# EAGLE design osi-brain_rev_1 (EAGLE 6.3)
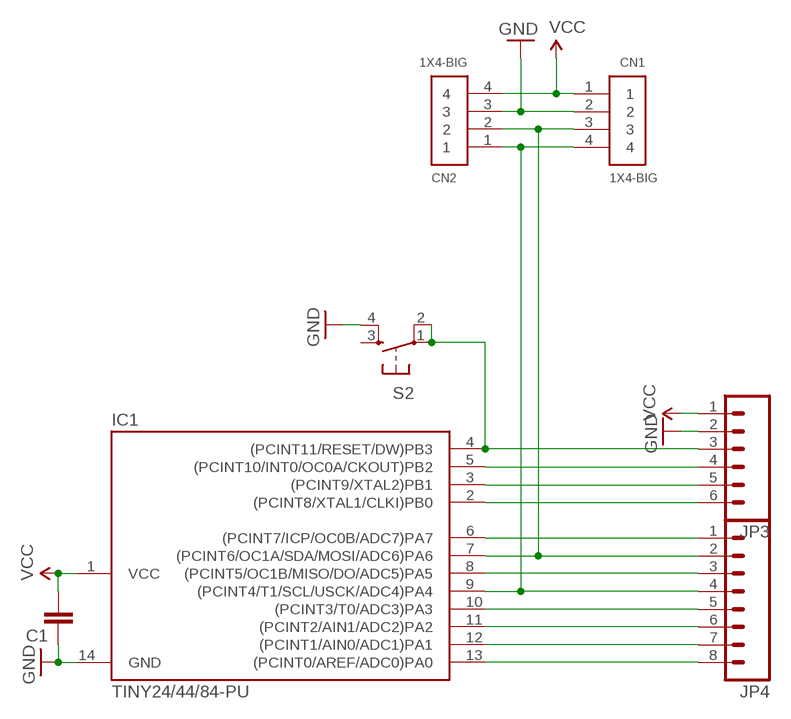
[diagram p0: schematic, sheet 1]

## Parts
C1  CAPKIT  [CAP-PTH-SMALL-KIT]
CN1  1X4-BIG  [1X04-BIG]
CN2  1X4-BIG  [1X04-BIG]
IC1  TINY24/44/84-PU  [DIL14]
JP3  M06SIP  [1X06]
JP4  M081X08  [1X08]
S2  TAC_SWITCHPTH  [TACTILE-PTH]

## Nets
D0: IC1.13((PCINT0/AREF/ADC0)PA0) JP4.8
D1: IC1.12((PCINT1/AIN0/ADC1)PA1) JP4.7
D2: IC1.11((PCINT2/AIN1/ADC2)PA2) JP4.6
D3: IC1.10((PCINT3/T0/ADC3)PA3) JP4.5
D4: CN1.4 CN2.1 IC1.9((PCINT4/T1/SCL/USCK/ADC4)PA4) JP4.4
D5: IC1.8((PCINT5/OC1B/MISO/DO/ADC5)PA5) JP4.3
D6: CN1.3 CN2.2 IC1.7((PCINT6/OC1A/SDA/MOSI/ADC6)PA6) JP4.2
D7: IC1.6((PCINT7/ICP/OC0B/ADC7)PA7) JP4.1
D8: IC1.5((PCINT10/INT0/OC0A/CKOUT)PB2) JP3.4
D9: IC1.3((PCINT9/XTAL2)PB1) JP3.5
D10: IC1.2((PCINT8/XTAL1/CLKI)PB0) JP3.6
GND: C1.1 CN1.2 CN2.3 IC1.14(GND) JP3.2 S2.4
RESET: IC1.4((PCINT11/RESET/DW)PB3) JP3.3 S2.1 S2.2
VCC: C1.2 CN1.1 CN2.4 IC1.1(VCC) JP3.1
Unconnected: S2.3

## Library data of the parts
C1 = SparkFun:CAP: Capacitor Standard 0603 ceramic capacitor, and 0.1" leaded capacitor.
CN1 CN2 = adafruit_mod:1X4: 4-pin connector
IC1 = avr-7:TINY24/44/84
JP3 = SparkFun_mod:M06: Header 6 Standard 6-pin 0.1" header. Use with straight break away headers (SKU : PRT-00116), right angle break away headers (PRT-00553), swiss pins (PRT-00743), machine pins (PRT-00117), and female headers (PRT-00115). Molex polarized connector foot print use with SKU : PRT-08094 with associated crimp pins and housings. NOTES ON THE VARIANTS LOCK and LOCK_LONGPADS... This footprint was designed to help hold the alignment of a through-hole component (i.e. 6-pin header) while soldering it into place. You may notice that each hole has been shifted either up or down by 0.005 of an inch from it's more standard position (which is a perfectly straight line). This slight alteration caused the pins (the squares in the middle) to touch the edges of the holes. Because they are alternating, it causes a "brace" to hold the component in place. 0.005 has proven to be the perfect amount of "off-center" position when using our standard breakaway headers. Although looks a little odd when you look at the bare footprint, once you have a header in there, the alteration is very hard to notice. Also, if you push a header all the way into place, it is covered up entirely on the bottom side. This idea of altering the position of holes to aid alignment will be further integrated into the Sparkfun Library for other footprints. It can help hold any component with 3 or more connection pins.
JP4 = SparkFun_mod:M08: Header 8 Standard 8-pin 0.1" header. Use with straight break away headers (SKU : PRT-00116), right angle break away headers (PRT-00553), swiss pins (PRT-00743), machine pins (PRT-00117), and female headers (PRT-00115).
S2 = SparkFun:TAC_SWITCH: Momentary Switch Button commonly used for reset or general input. Spark Fun Electronics SKU : COM-00097

## Board
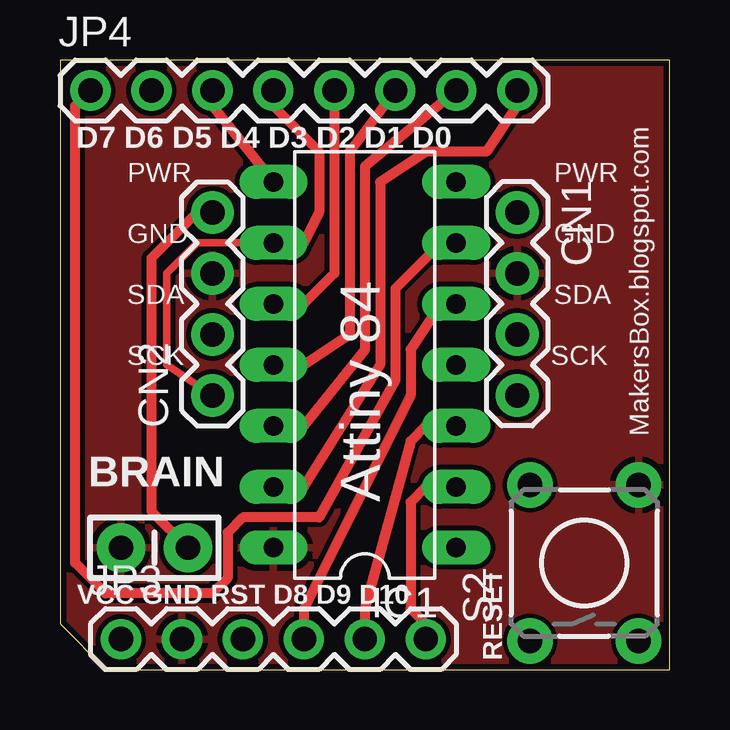
[diagram p1: board, top side]
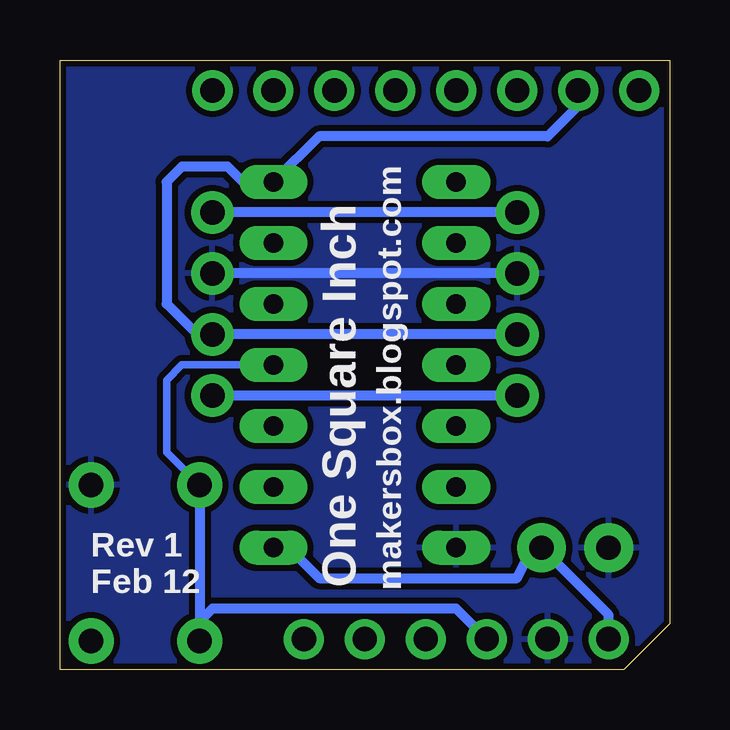
[diagram p2: board, bottom side, seen from below]

Size 25.4 x 25.4 mm. Coordinates in mm from the lower left corner, seen from the top.
Outline: 1.91,0 24.77,0 24.77,0 25.4,0 25.4,24.77 25.4,25.4 24.77,25.4 0.64,25.4 0,25.4 0,24.77 0,1.91 1.91,0
Copper layers (1*16): Top 0.035mm / dielectric 1.5mm / Bottom 0.035mm
Design rules "SparkFun": minimum track width 8mil, minimum drill 20mil, track to track 8mil, track to pad 8mil, pad to pad 8mil, via to via 8mil, smd to smd 8mil, copper to edge 10mil, drill to drill 8mil, minimum pad ring 12mil, minimum via ring 10mil, stop-mask expansion 4mil, vias tented up to drill 25mil, thermal gap 10mil

### Footprints (pad centres in the part's own frame; a part is rotated, then mirrored left to right if it is on the bottom)
CAP-PTH-SMALL-KIT = drill 1.016 pad 2.032: 1 -1.397,0; 2 1.397,0
1X04-BIG = drill 1.016 pad 1.778: 1 0,0; 2 2.54,0; 3 5.08,0; 4 7.62,0
DIL14 = drill 0.813 long: 1 -7.62,-3.81; 2 -5.08,-3.81; 3 -2.54,-3.81; 4 0,-3.81; 5 2.54,-3.81; 6 5.08,-3.81; 7 7.62,-3.81; 8 7.62,3.81; 9 5.08,3.81; 10 2.54,3.81; 11 0,3.81; 12 -2.54,3.81; 13 -5.08,3.81; 14 -7.62,3.81
1X06 = drill 1.016 pad 1.676: 1 0,0; 2 2.54,0; 3 5.08,0; 4 7.62,0; 5 10.16,0; 6 12.7,0
1X08 = drill 1.016 pad 1.676: 1 0,0; 2 2.54,0; 3 5.08,0; 4 7.62,0; 5 10.16,0; 6 12.7,0; 7 15.24,0; 8 17.78,0
TACTILE-PTH = drill 1.016 pad 1.88: 1 -3.251,2.261; 2 3.251,2.261; 3 -3.251,-2.261; 4 3.251,-2.261

### Placement (x,y rotation side)
C1  3.94,5.08 0 top
CN1  19.05,19.05 270 top
CN2  6.35,11.43 90 top
IC1  12.7,12.7 90 top
JP3  2.54,1.27 0 top
JP4  1.27,24.13 0 top
S2  21.84,4.45 90 top

### Tracks (layer width: path | path; a pad name or v marks a point on that pad's centre or on a via)
D0
  Top 0.406: JP4.8 19.05,23.5 17.78,21.59 15.24,21.59 13.34,20.32 13.34,12.7 10.16,7.62 IC1.13
D1
  Top 0.406: JP4.7 12.7,20.95 12.7,13.34 10.16,10.16 IC1.12
D2
  Top 0.406: JP4.6 12.06,21.59 12.06,13.97 10.16,12.7 IC1.11
D3
  Top 0.406: JP4.5 11.43,16.51 10.16,15.24 IC1.10
D4
  Top 0.305: IC1.9 5.71,17.78 4.45,16.51 4.45,12.7 CN2.1
  Top 0.406: JP4.4 8.89,23.5 10.79,21.59 10.79,19.05 10.16,17.78 IC1.9
  Bottom 0.406: CN1.4 CN2.1
D5
  Top 0.406: JP4.3 6.35,23.5 IC1.8
D6
  Bottom 0.406: JP4.2 3.81,23.5 5.08,22.23 14.61,22.23 IC1.7 17.78,20.32 18.41,20.95 20.32,20.95 20.95,20.32 20.95,15.24 19.68,13.97 CN1.3 CN2.2
D7
  Top 0.406: IC1.6 15.88,17.78 13.97,15.88 13.97,12.06 10.79,6.35 7.62,6.35 6.99,5.71 6.99,3.81 6.35,3.17 1.91,3.17 0.64,4.45 0.64,23.5 JP4.1
D8
  Top 0.406: IC1.5 15.88,15.24 14.61,13.34 14.61,11.43 10.16,2.54 JP3.4
D9
  Top 0.406: IC1.3 15.24,10.16 14.61,9.53 12.7,2.54 JP3.5
D10
  Top 0.406: IC1.2 15.24,7.62 14.61,6.99 14.61,2.54 15.24,1.91 JP3.6
GND
  Bottom 0.406: CN2.3 CN1.2
  pour Bottom (isolate 0.254): -1.27,26.67 26.67,26.67 26.67,-1.27 -1.27,-1.27
  pour Top: -0.64,26.04 26.67,26.04 26.67,0 26.04,-0.64 -0.64,-0.64
RESET
  Bottom 0.305: IC1.4 20.32,12.7 20.95,12.06 20.95,9.07 S2.2
  Bottom 0.406: JP3.3 8.89,2.54 19.05,2.54 19.68,1.91 19.68,1.29 S2.1 S2.2
VCC
  Top 0.406: CN2.4 5.71,19.05 3.81,17.14 3.81,6.6 C1.2
  Bottom 0.406: CN2.4 CN1.1 | IC1.1 15.88,5.08 14.61,3.81 6.35,3.81 5.71,5.08 5.71,4.83 C1.2 2.54,2.29 JP3.1

### Text on the board
tPlace: D7 D6 D5 D4 D3 D2 D1 D0 | PWR | PWR | GND | GND | SDA | SDA | SCK | SCK | MakersBox.blogspot.com | BRAIN | Attiny 84 | VCC GND RST D8 D9 D10 | RESET
bPlace: makersbox.blogspot.com | One Square Inch | Rev 1 / Feb 12